# Altium schematic sheet FPGA2.SchDoc: Cypress Molson - FPGA2
size C; DrawnBy: G. Cosens; Engineer: G. Cosens; Organization: Linear Systems Ltd.; Address1: 1-1717 Dublin Ave.; Address2: Winnipeg, MB, Canada; Address3: R3H 0H2; DocumentNumber: LS7652; Revision: 1; SheetNumber: 05; SheetTotal: 12
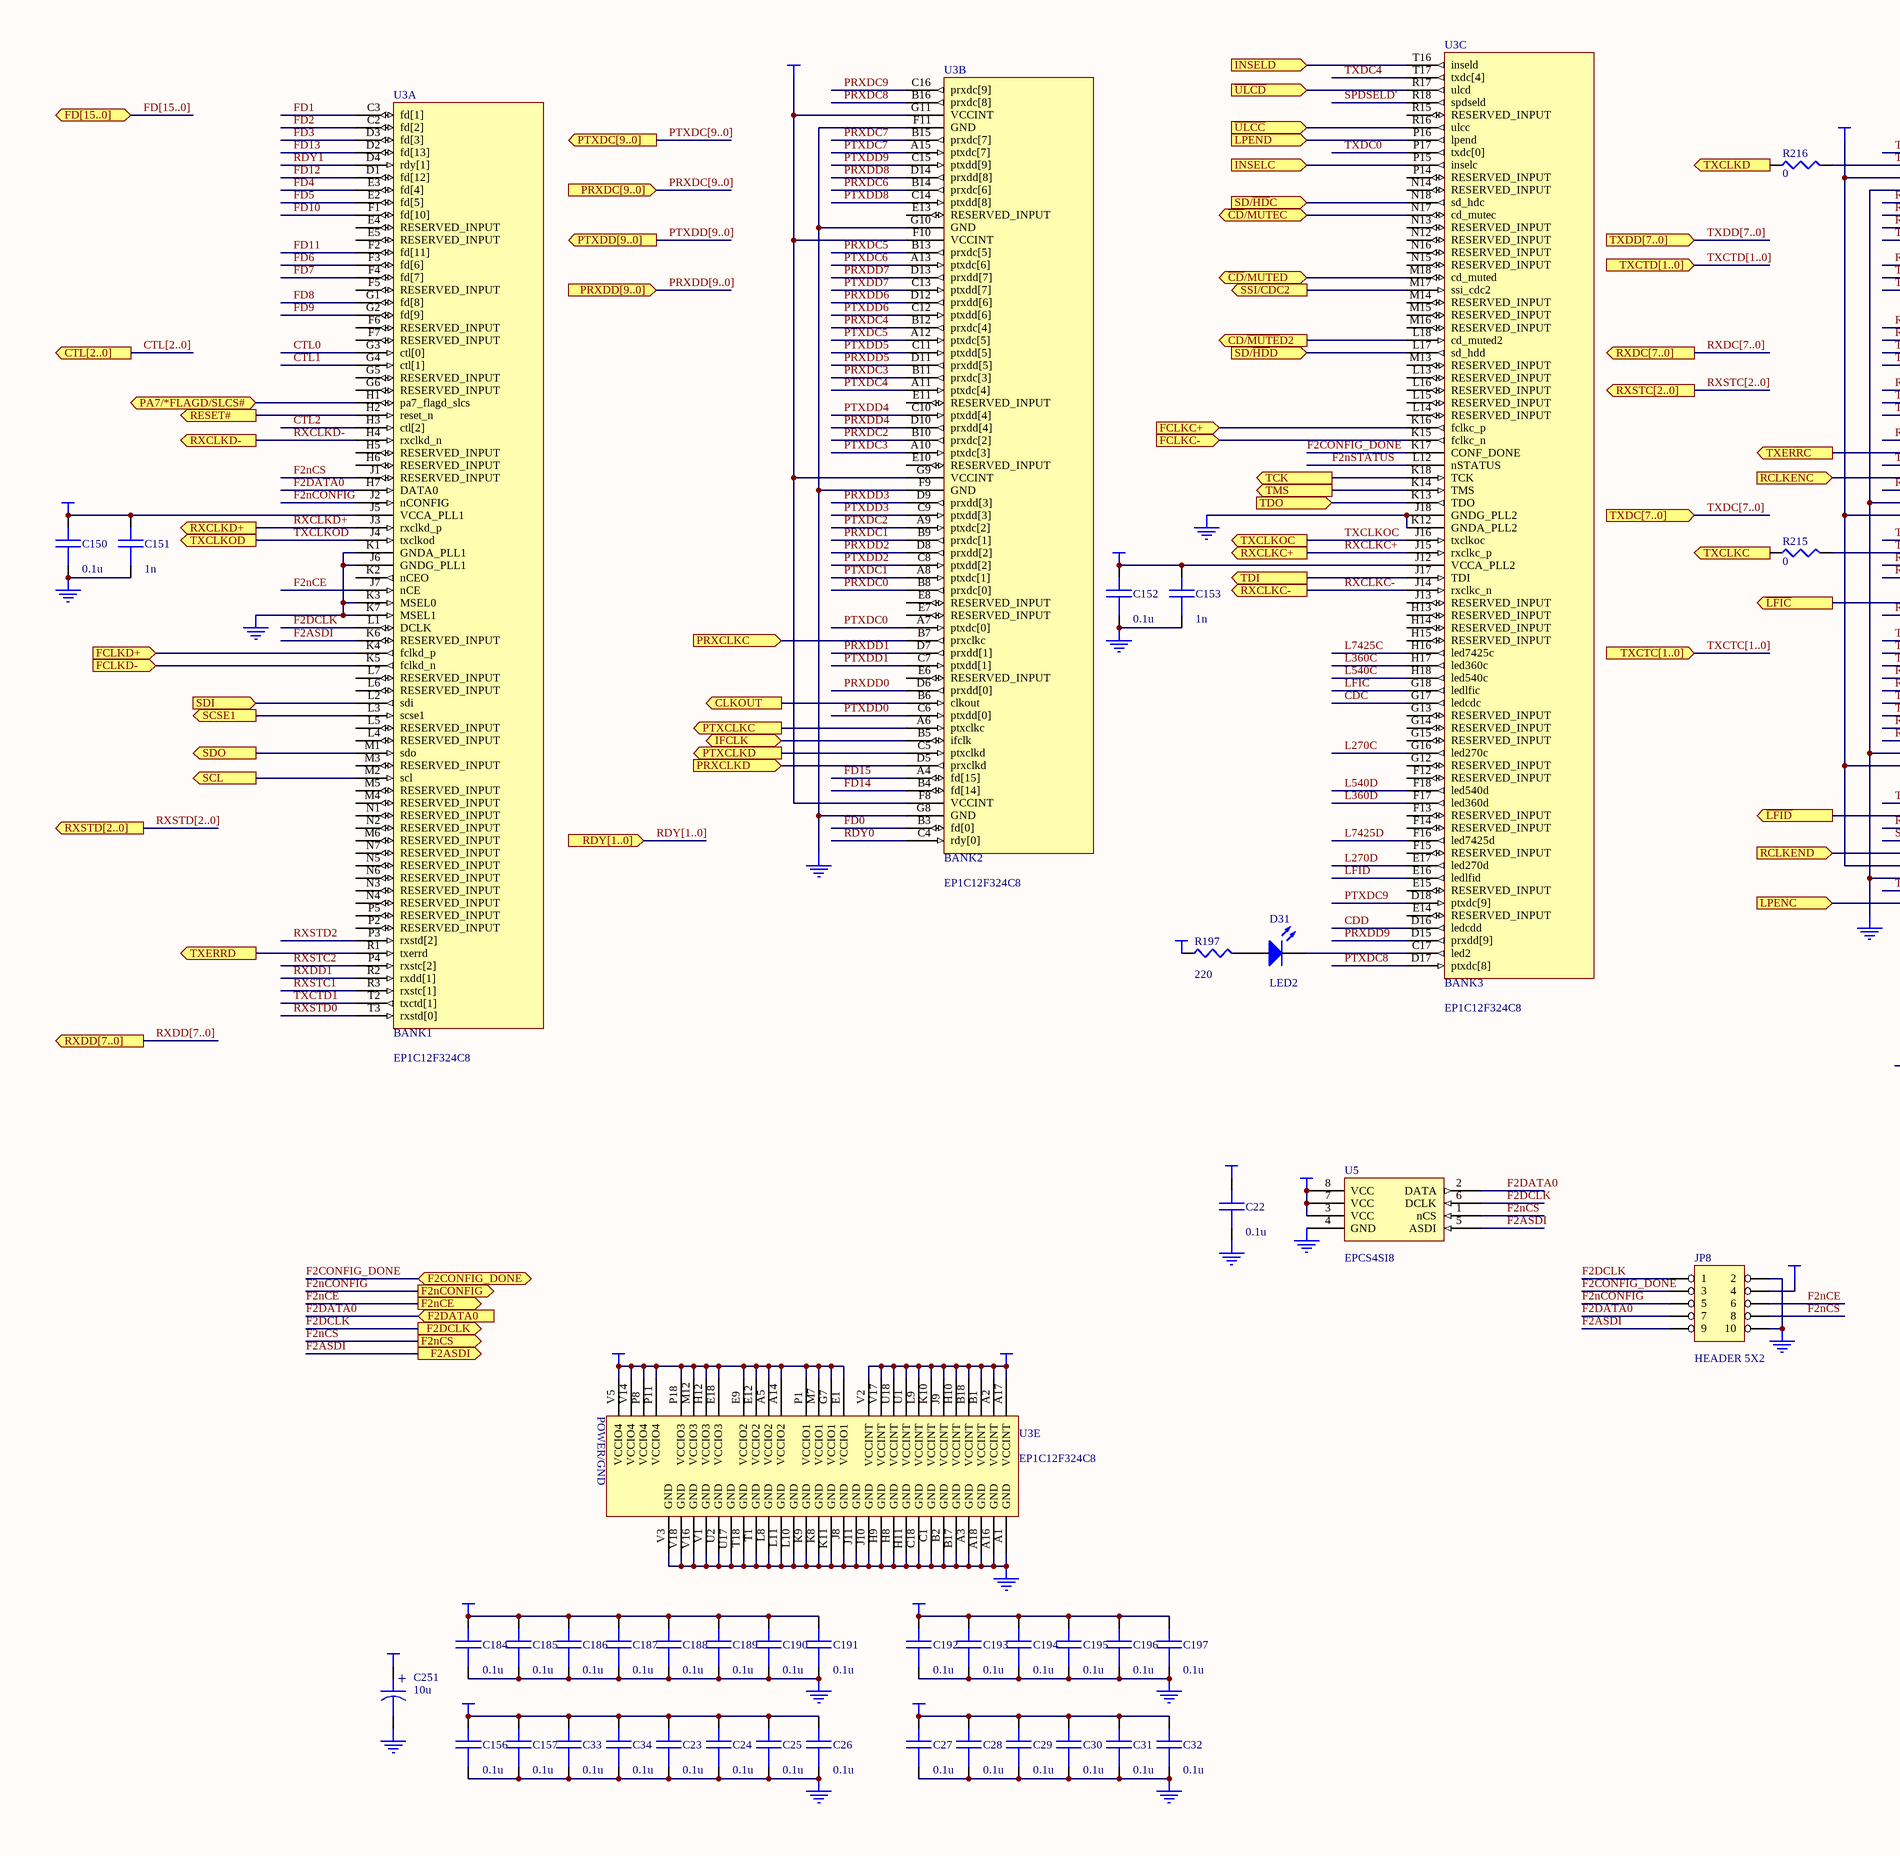
[diagram p0: FPGA2.SchDoc, left]
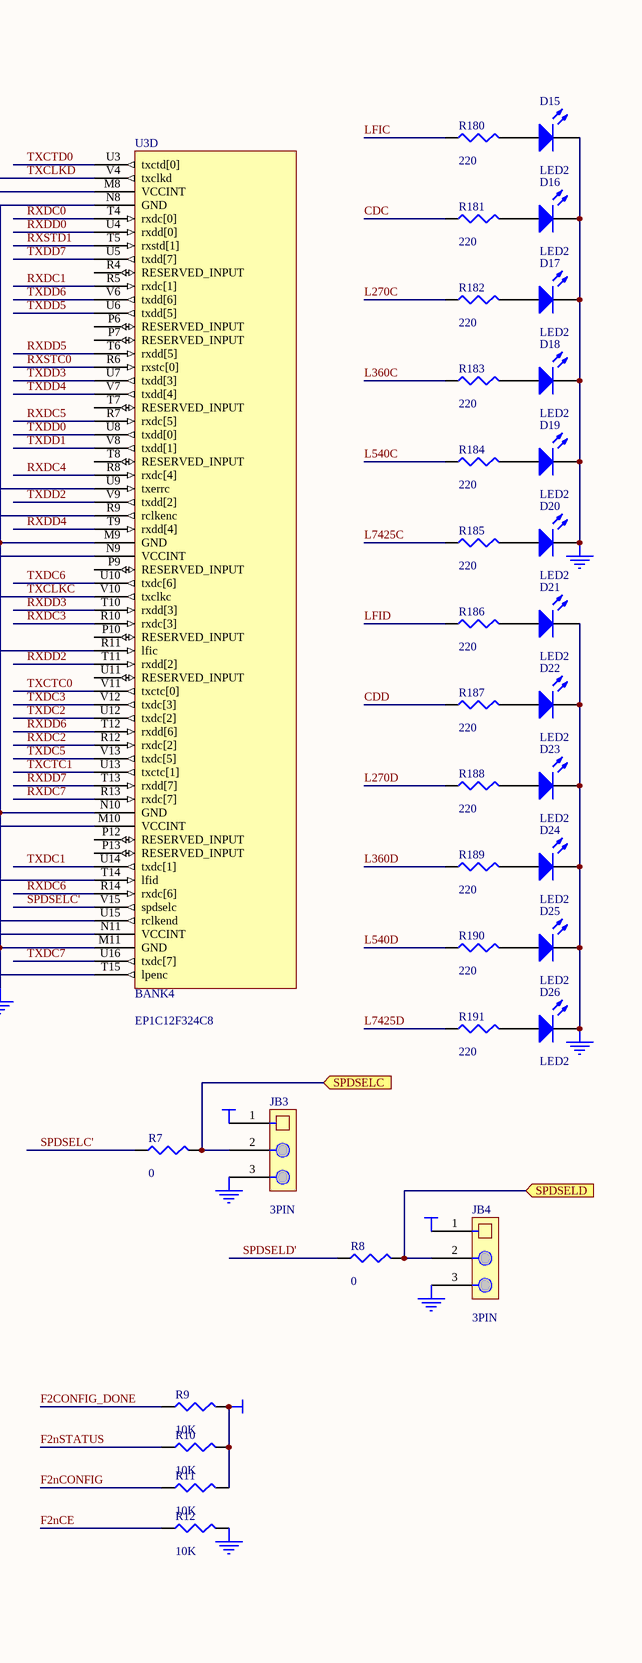
[diagram p1: FPGA2.SchDoc, right]

## Parts
C22  (no value)  [0603]
C23  (no value)  [0603]
C24  (no value)  [0603]
C25  (no value)  [0603]
C26  (no value)  [0603]
C27  (no value)  [0603]
C28  (no value)  [0603]
C29  (no value)  [0603]
C30  (no value)  [0603]
C31  (no value)  [0603]
C32  (no value)  [0603]
C33  (no value)  [0603]
C34  (no value)  [0603]
C150  (no value)  [0603]
C151  (no value)  [0603]
C152  (no value)  [0603]
C153  (no value)  [0603]
C156  (no value)  [0603]
C157  (no value)  [0603]
C184  (no value)  [0603]
C185  (no value)  [0603]
C186  (no value)  [0603]
C187  (no value)  [0603]
C188  (no value)  [0603]
C189  (no value)  [0603]
C190  (no value)  [0603]
C191  (no value)  [0603]
C192  (no value)  [0603]
C193  (no value)  [0603]
C194  (no value)  [0603]
C195  (no value)  [0603]
C196  (no value)  [0603]
C197  (no value)  [0603]
C251  10u  [6032]
D15  LED2  [0603D]
D16  LED2  [0603D]
D17  LED2  [0603D]
D18  LED2  [0603D]
D19  LED2  [0603D]
D20  LED2  [0603D]
D21  LED2  [0603D]
D22  LED2  [0603D]
D23  LED2  [0603D]
D24  LED2  [0603D]
D25  LED2  [0603D]
D26  LED2  [0603D]
D31  LED2  [0603D]
JB3  3PIN  [3X1PIN]
JB4  3PIN  [3X1PIN]
JP8  (no value)  [2X5PIN]
R7  0  [0603]
R8  0  [0603]
R9  10K  [0603]
R10  10K  [0603]
R11  10K  [0603]
R12  10K  [0603]
R180  220  [0603]
R181  220  [0603]
R182  220  [0603]
R183  220  [0603]
R184  220  [0603]
R185  220  [0603]
R186  220  [0603]
R187  220  [0603]
R188  220  [0603]
R189  220  [0603]
R190  220  [0603]
R191  220  [0603]
R197  220  [0603]
R215  0  [0603]
R216  0  [0603]
U3  EP1C12F324C8  [BGA19X19-B324]  (parts A,B,C,D,E of 5)
U5  (no value)  [SO-8]

## Ports
CD/~{MUTE}D2 (out), CLKOUT (out), CTL[2..0] (out), F2ASDI (out), F2CONFIG_DONE (bidir), F2DATA0 (in), F2DCLK (out), F2nCE (out), F2nCONFIG (out), F2nCS (out), FCLKC+ (in), FCLKC- (in), FCLKD+ (in), FCLKD- (in), FD[15..0] (bidir), IFCLK (bidir), INSELC (in), INSELD (in), LPENC (in), LPEND (in), PA7/*FLAGD/SLCS# (bidir), PRXCLKC (in), PRXCLKD (in), PRXDC[9..0] (in), PRXDD[9..0] (in), PTXCLKC (out), PTXCLKD (out), PTXDC[9..0] (out), PTXDD[9..0] (out), RCLKENC (in), RCLKEND (in), RDY[1..0] (in), RESET# (out), RXCLKC+ (out), RXCLKC- (out), RXCLKD+ (out), RXCLKD- (out), RXDC[7..0] (out), RXDD[7..0] (out), RXSTC[2..0] (out), RXSTD[2..0] (out), SCL (out), SCSE1 (out), SD/~{HD}C (in), SD/~{HD}D (in), SDI (in), SDO (out), SPDSELC (in), SPDSELD (in), SSI/CDC2 (out), TCK (out), TDI (out), TDO (in), TMS (out), TXCLKC (in), TXCLKD (in), TXCLKOC (out), TXCLKOD (out), TXCTC[1..0] (in), TXCTD[1..0] (in), TXDC[7..0] (in), TXDD[7..0] (in), TXERRC (out), TXERRD (out), ~{CD}/MUTEC (bidir), ~{CD}/MUTED (bidir), ~{LFIC} (out), ~{LFID} (out), ~{ULCC} (in), ~{ULCD} (in)

## Nets
+1.5V: C27.1 C28.1 C29.1 C30.1 C31.1 C32.1 C192.1 C193.1 C194.1 C195.1 C196.1 C197.1 U3.A2(VCCINT) U3.A17(VCCINT) U3.B1(VCCINT) U3.B18(VCCINT) U3.F8(VCCINT) U3.F10(VCCINT) U3.G9(VCCINT) U3.G11(VCCINT) U3.H10(VCCINT) U3.J9(VCCINT) U3.K10(VCCINT) U3.L9(VCCINT) U3.M8(VCCINT) U3.M10(VCCINT) U3.N9(VCCINT) U3.N11(VCCINT) U3.U1(VCCINT) U3.U18(VCCINT) U3.V2(VCCINT) U3.V17(VCCINT)
+1.5VA: C150.1 C151.1 C152.1 C153.1 U3.J5(VCCA_PLL1) U3.J12(VCCA_PLL2)
+3.3V: C22.1 C23.1 C24.1 C25.1 C26.1 C33.1 C34.1 C156.1 C157.1 C184.1 C185.1 C186.1 C187.1 C188.1 C189.1 C190.1 C191.1 C251.1 JB3.1 JB4.1 JP8.4 R9.2 R10.2 R11.2 R197.1 U3.A5(VCCIO2) U3.A14(VCCIO2) U3.E1(VCCIO1) U3.E9(VCCIO2) U3.E12(VCCIO2) U3.E18(VCCIO3) U3.G7(VCCIO1) U3.H12(VCCIO3) U3.M7(VCCIO1) U3.M12(VCCIO3) U3.P1(VCCIO1) U3.P8(VCCIO4) U3.P11(VCCIO4) U3.P18(VCCIO3) U3.V5(VCCIO4) U3.V14(VCCIO4) U5.3(VCC) U5.7(VCC) U5.8(VCC)
GND: C22.2 C23.2 C24.2 C25.2 C26.2 C27.2 C28.2 C29.2 C30.2 C31.2 C32.2 C33.2 C34.2 C150.2 C151.2 C152.2 C153.2 C156.2 C157.2 C184.2 C185.2 C186.2 C187.2 C188.2 C189.2 C190.2 C191.2 C192.2 C193.2 C194.2 C195.2 C196.2 C197.2 C251.2 D15.2(K) D16.2(K) D17.2(K) D18.2(K) D19.2(K) D20.2(K) D21.2(K) D22.2(K) D23.2(K) D24.2(K) D25.2(K) D26.2(K) JB3.3 JB4.3 JP8.2 JP8.10 R12.2 U3.A1(GND) U3.A3(GND) U3.A16(GND) U3.A18(GND) U3.B2(GND) U3.B17(GND) U3.C1(GND) U3.C18(GND) U3.F9(GND) U3.F11(GND) U3.G8(GND) U3.G10(GND) U3.H8(GND) U3.H9(GND) U3.H11(GND) U3.J6(GNDG_PLL1) U3.J8(GND) U3.J10(GND) U3.J11(GND) U3.J18(GNDG_PLL2) U3.K1(GNDA_PLL1) U3.K3(MSEL0) U3.K7(MSEL1) U3.K8(GND) U3.K9(GND) U3.K11(GND) U3.K12(GNDA_PLL2) U3.L8(GND) U3.L10(GND) U3.L11(GND) U3.M9(GND) U3.M11(GND) U3.N8(GND) U3.N10(GND) U3.T1(GND) U3.T18(GND) U3.U2(GND) U3.U17(GND) U3.V1(GND) U3.V3(GND) U3.V16(GND) U3.V18(GND) U5.4(GND)
~{CD}/MUTEC: U3.N17(cd_mutec) ; port ~{CD}/MUTEC
~{CD}/MUTED: U3.M18(cd_muted) ; port ~{CD}/MUTED
CD/~{MUTE}D2: U3.L18(cd_muted2) ; port CD/~{MUTE}D2
CDC: R181.1 U3.G17(ledcdc)
CDD: R187.1 U3.D16(ledcdd)
CLKOUT: U3.B6(clkout) ; port CLKOUT
CTL0: U3.G3(ctl[0])
CTL1: U3.G4(ctl[1])
CTL2: U3.H3(ctl[2])
F2ASDI: JP8.9 U3.K6(RESERVED_INPUT) U5.5(ASDI) ; port F2ASDI
F2CONFIG_DONE: JP8.3 R9.1 U3.K17(CONF_DONE) ; port F2CONFIG_DONE
F2DATA0: JP8.7 U3.H7(DATA0) U5.2(DATA) ; port F2DATA0
F2DCLK: JP8.1 U3.L1(DCLK) U5.6(DCLK) ; port F2DCLK
F2nCE: JP8.6 R12.1 U3.J7(nCE) ; port F2nCE
F2nCONFIG: JP8.5 R11.1 U3.J2(nCONFIG) ; port F2nCONFIG
F2nCS: JP8.8 U3.J1(RESERVED_INPUT) U5.1(nCS) ; port F2nCS
F2nSTATUS: R10.1 U3.L12(nSTATUS)
FCLKC+: U3.K16(fclkc_p) ; port FCLKC+
FCLKC-: U3.K15(fclkc_n) ; port FCLKC-
FCLKD+: U3.K4(fclkd_p) ; port FCLKD+
FCLKD-: U3.K5(fclkd_n) ; port FCLKD-
FD0: U3.B3(fd[0])
FD1: U3.C3(fd[1])
FD2: U3.C2(fd[2])
FD3: U3.D3(fd[3])
FD4: U3.E3(fd[4])
FD5: U3.E2(fd[5])
FD6: U3.F3(fd[6])
FD7: U3.F4(fd[7])
FD8: U3.G1(fd[8])
FD9: U3.G2(fd[9])
FD10: U3.F1(fd[10])
FD11: U3.F2(fd[11])
FD12: U3.D1(fd[12])
FD13: U3.D2(fd[13])
FD14: U3.B4(fd[14])
FD15: U3.A4(fd[15])
IFCLK: U3.B5(ifclk) ; port IFCLK
INSELC: U3.P15(inselc) ; port INSELC
INSELD: U3.T16(inseld) ; port INSELD
L270C: R182.1 U3.G16(led270c)
L270D: R188.1 U3.E17(led270d)
L360C: R183.1 U3.H17(led360c)
L360D: R189.1 U3.F17(led360d)
L540C: R184.1 U3.H18(led540c)
L540D: R190.1 U3.F18(led540d)
L7425C: R185.1 U3.H16(led7425c)
L7425D: R191.1 U3.F16(led7425d)
~{LFIC}: U3.R11(lfic) ; port ~{LFIC}
~{LFID}: U3.T14(lfid) ; port ~{LFID}
LFIC: R180.1 U3.G18(ledlfic)
LFID: R186.1 U3.E16(ledlfid)
LPENC: U3.T15(lpenc) ; port LPENC
LPEND: U3.P16(lpend) ; port LPEND
PA7/*FLAGD/SLCS#: U3.H1(pa7_flagd_slcs) ; port PA7/*FLAGD/SLCS#
PRXCLKC: U3.B7(prxclkc) ; port PRXCLKC
PRXCLKD: U3.D5(prxclkd) ; port PRXCLKD
PRXDC0: U3.B8(prxdc[0])
PRXDC1: U3.B9(prxdc[1])
PRXDC2: U3.B10(prxdc[2])
PRXDC3: U3.B11(prxdc[3])
PRXDC4: U3.B12(prxdc[4])
PRXDC5: U3.B13(prxdc[5])
PRXDC6: U3.B14(prxdc[6])
PRXDC7: U3.B15(prxdc[7])
PRXDC8: U3.B16(prxdc[8])
PRXDC9: U3.C16(prxdc[9])
PRXDD0: U3.D6(prxdd[0])
PRXDD1: U3.D7(prxdd[1])
PRXDD2: U3.D8(prxdd[2])
PRXDD3: U3.D9(prxdd[3])
PRXDD4: U3.D10(prxdd[4])
PRXDD5: U3.D11(prxdd[5])
PRXDD6: U3.D12(prxdd[6])
PRXDD7: U3.D13(prxdd[7])
PRXDD8: U3.D14(prxdd[8])
PRXDD9: U3.D15(prxdd[9])
PTXCLKC: U3.A6(ptxclkc) ; port PTXCLKC
PTXCLKD: U3.C5(ptxclkd) ; port PTXCLKD
PTXDC0: U3.A7(ptxdc[0])
PTXDC1: U3.A8(ptxdc[1])
PTXDC2: U3.A9(ptxdc[2])
PTXDC3: U3.A10(ptxdc[3])
PTXDC4: U3.A11(ptxdc[4])
PTXDC5: U3.A12(ptxdc[5])
PTXDC6: U3.A13(ptxdc[6])
PTXDC7: U3.A15(ptxdc[7])
PTXDC8: U3.D17(ptxdc[8])
PTXDC9: U3.D18(ptxdc[9])
PTXDD0: U3.C6(ptxdd[0])
PTXDD1: U3.C7(ptxdd[1])
PTXDD2: U3.C8(ptxdd[2])
PTXDD3: U3.C9(ptxdd[3])
PTXDD4: U3.C10(ptxdd[4])
PTXDD5: U3.C11(ptxdd[5])
PTXDD6: U3.C12(ptxdd[6])
PTXDD7: U3.C13(ptxdd[7])
PTXDD8: U3.C14(ptxdd[8])
PTXDD9: U3.C15(ptxdd[9])
RCLKENC: U3.R9(rclkenc) ; port RCLKENC
RCLKEND: U3.U15(rclkend) ; port RCLKEND
RDY0: U3.C4(rdy[0])
RDY1: U3.D4(rdy[1])
RESET#: U3.H2(reset_n) ; port RESET#
RXCLKC+: U3.J15(rxclkc_p) ; port RXCLKC+
RXCLKC-: U3.J14(rxclkc_n) ; port RXCLKC-
RXCLKD+: U3.J3(rxclkd_p) ; port RXCLKD+
RXCLKD-: U3.H4(rxclkd_n) ; port RXCLKD-
RXDC0: U3.T4(rxdc[0])
RXDC1: U3.R5(rxdc[1])
RXDC2: U3.R12(rxdc[2])
RXDC3: U3.R10(rxdc[3])
RXDC4: U3.R8(rxdc[4])
RXDC5: U3.R7(rxdc[5])
RXDC6: U3.R14(rxdc[6])
RXDC7: U3.R13(rxdc[7])
RXDD0: U3.U4(rxdd[0])
RXDD1: U3.R2(rxdd[1])
RXDD2: U3.T11(rxdd[2])
RXDD3: U3.T10(rxdd[3])
RXDD4: U3.T9(rxdd[4])
RXDD5: U3.T6(rxdd[5])
RXDD6: U3.T12(rxdd[6])
RXDD7: U3.T13(rxdd[7])
RXSTC0: U3.R6(rxstc[0])
RXSTC1: U3.R3(rxstc[1])
RXSTC2: U3.P4(rxstc[2])
RXSTD0: U3.T3(rxstd[0])
RXSTD1: U3.T5(rxstd[1])
RXSTD2: U3.P3(rxstd[2])
SCL: U3.M2(scl) ; port SCL
SCSE1: U3.L3(scse1) ; port SCSE1
SD/~{HD}C: U3.N18(sd_hdc) ; port SD/~{HD}C
SD/~{HD}D: U3.L17(sd_hdd) ; port SD/~{HD}D
SDI: U3.L2(sdi) ; port SDI
SDO: U3.M1(sdo) ; port SDO
SPDSELC: JB3.2 R7.2 ; port SPDSELC
SPDSELC': R7.1 U3.V15(spdselc)
SPDSELD: JB4.2 R8.2 ; port SPDSELD
SPDSELD': R8.1 U3.R18(spdseld)
SSI/CDC2: U3.M17(ssi_cdc2) ; port SSI/CDC2
TCK: U3.K18(TCK) ; port TCK
TDI: U3.J17(TDI) ; port TDI
TDO: U3.K13(TDO) ; port TDO
TMS: U3.K14(TMS) ; port TMS
TXCLKC: R215.2 U3.V10(txclkc)
TXCLKC: R215.1 ; port TXCLKC  [a separate net that carries the same name]
TXCLKD: R216.2 U3.V4(txclkd)
TXCLKD: R216.1 ; port TXCLKD  [a separate net that carries the same name]
TXCLKOC: U3.J16(txclkoc) ; port TXCLKOC
TXCLKOD: U3.J4(txclkod) ; port TXCLKOD
TXCTC0: U3.V11(txctc[0])
TXCTC1: U3.U13(txctc[1])
TXCTD0: U3.U3(txctd[0])
TXCTD1: U3.T2(txctd[1])
TXDC0: U3.P17(txdc[0])
TXDC1: U3.U14(txdc[1])
TXDC2: U3.U12(txdc[2])
TXDC3: U3.V12(txdc[3])
TXDC4: U3.T17(txdc[4])
TXDC5: U3.V13(txdc[5])
TXDC6: U3.U10(txdc[6])
TXDC7: U3.U16(txdc[7])
TXDD0: U3.U8(txdd[0])
TXDD1: U3.V8(txdd[1])
TXDD2: U3.V9(txdd[2])
TXDD3: U3.U7(txdd[3])
TXDD4: U3.V7(txdd[4])
TXDD5: U3.U6(txdd[5])
TXDD6: U3.V6(txdd[6])
TXDD7: U3.U5(txdd[7])
TXERRC: U3.U9(txerrc) ; port TXERRC
TXERRD: U3.R1(txerrd) ; port TXERRD
~{ULCC}: U3.R16(ulcc) ; port ~{ULCC}
~{ULCD}: U3.R17(ulcd) ; port ~{ULCD}
NetD15_1: D15.1(A) R180.2
NetD16_1: D16.1(A) R181.2
NetD17_1: D17.1(A) R182.2
NetD18_1: D18.1(A) R183.2
NetD19_1: D19.1(A) R184.2
NetD20_1: D20.1(A) R185.2
NetD21_1: D21.1(A) R186.2
NetD22_1: D22.1(A) R187.2
NetD23_1: D23.1(A) R188.2
NetD24_1: D24.1(A) R189.2
NetD25_1: D25.1(A) R190.2
NetD26_1: D26.1(A) R191.2
NetD31_1: D31.1(A) R197.2
NetD31_2: D31.2(K) U3.C17(led2)

Not connected (* = marked no-connect by the designer): U3 E4(RESERVED_INPUT) E5(RESERVED_INPUT) E6(RESERVED_INPUT) E7(RESERVED_INPUT) E8(RESERVED_INPUT) E10(RESERVED_INPUT) E11(RESERVED_INPUT) E13(RESERVED_INPUT) E14(RESERVED_INPUT) E15(RESERVED_INPUT) F5(RESERVED_INPUT) F6(RESERVED_INPUT) F7(RESERVED_INPUT) F12(RESERVED_INPUT) F13(RESERVED_INPUT) F14(RESERVED_INPUT) F15(RESERVED_INPUT) G5(RESERVED_INPUT) G6(RESERVED_INPUT) G12(RESERVED_INPUT) G13(RESERVED_INPUT) G14(RESERVED_INPUT) G15(RESERVED_INPUT) H5(RESERVED_INPUT) H6(RESERVED_INPUT) H13(RESERVED_INPUT) H14(RESERVED_INPUT) H15(RESERVED_INPUT) J13(RESERVED_INPUT) K2(nCEO) L4(RESERVED_INPUT) L5(RESERVED_INPUT) L6(RESERVED_INPUT) L7(RESERVED_INPUT) L13(RESERVED_INPUT) L14(RESERVED_INPUT) L15(RESERVED_INPUT) L16(RESERVED_INPUT) M3(RESERVED_INPUT) M4(RESERVED_INPUT) M5(RESERVED_INPUT) M6(RESERVED_INPUT) M13(RESERVED_INPUT) M14(RESERVED_INPUT) M15(RESERVED_INPUT) M16(RESERVED_INPUT) N1(RESERVED_INPUT) N2(RESERVED_INPUT) N3(RESERVED_INPUT) N4(RESERVED_INPUT) N5(RESERVED_INPUT) N6(RESERVED_INPUT) N7(RESERVED_INPUT) N12(RESERVED_INPUT) N13(RESERVED_INPUT) N14(RESERVED_INPUT) N15(RESERVED_INPUT) N16(RESERVED_INPUT) P2(RESERVED_INPUT) P5(RESERVED_INPUT) P6(RESERVED_INPUT) P7(RESERVED_INPUT) P9(RESERVED_INPUT) P10(RESERVED_INPUT) P12(RESERVED_INPUT) P13(RESERVED_INPUT) P14(RESERVED_INPUT) R4(RESERVED_INPUT) R15(RESERVED_INPUT) T7(RESERVED_INPUT) T8(RESERVED_INPUT) U11(RESERVED_INPUT)

## Buses and harness runs
bus CTL[2..0] = port CTL[2..0]
bus FD[15..0] = port FD[15..0]
bus PRXDC[9..0] = port PRXDC[9..0]
bus PRXDD[9..0] = port PRXDD[9..0]
bus PTXDC[9..0] = port PTXDC[9..0]
bus PTXDD[9..0] = port PTXDD[9..0]
bus RDY[1..0] = port RDY[1..0]
bus RXDC[7..0] = port RXDC[7..0]
bus RXDD[7..0] = port RXDD[7..0]
bus RXSTC[2..0] = port RXSTC[2..0]
bus RXSTD[2..0] = port RXSTD[2..0]
bus TXCTC[1..0] = port TXCTC[1..0]
bus TXCTD[1..0] = port TXCTD[1..0]
bus TXDC[7..0] = port TXDC[7..0]
bus TXDD[7..0] = port TXDD[7..0]

## Notes on the sheet
- Size
- Date:
- File:
- B
- Drawing Number
- Sheet
- Drawn By:
- G. Cosens
- Revision
- of
- (in symbol CAPACITOR POL) +
- (in symbol EP1C12F324C8_2, part A) BANK1
- (in symbol EP1C12F324C8_2, part B) BANK2
- (in symbol EP1C12F324C8_2, part C) BANK3
- (in symbol EP1C12F324C8_2, part D) BANK4
- (in symbol EP1C12F324C8_2, part E) POWER/GND

## Library data of the parts
C22-C34 C150-C153 C156 C157 C184-C197 = CAP: SMT CAP
C251 = CAPACITOR POL: Text Field1: 20; Text Field2: 20
D15-D26 D31 = LED2: Typical RED, GREEN, YELLOW, AMBER GaAs LED; Manufacturer: Generic Components; Class I: Optoelectronic; Published: 8-Jun-2000; Revision: July-2002: Re-released for DXP Platform.; Publisher: Altium Limited; Class II: LED
JB3 JB4 = 3PIN: 3X1PIN
JP8 = HEADER 5X2: Text Field1: 40; Text Field2: 60
R7-R12 R180-R191 R197 R215 R216 = RES1
U3 = EP1C12F324C8_2
U5 = EPCS4SI8